# EAGLE design rel-eeprom-prog (EAGLE 9.1.3)
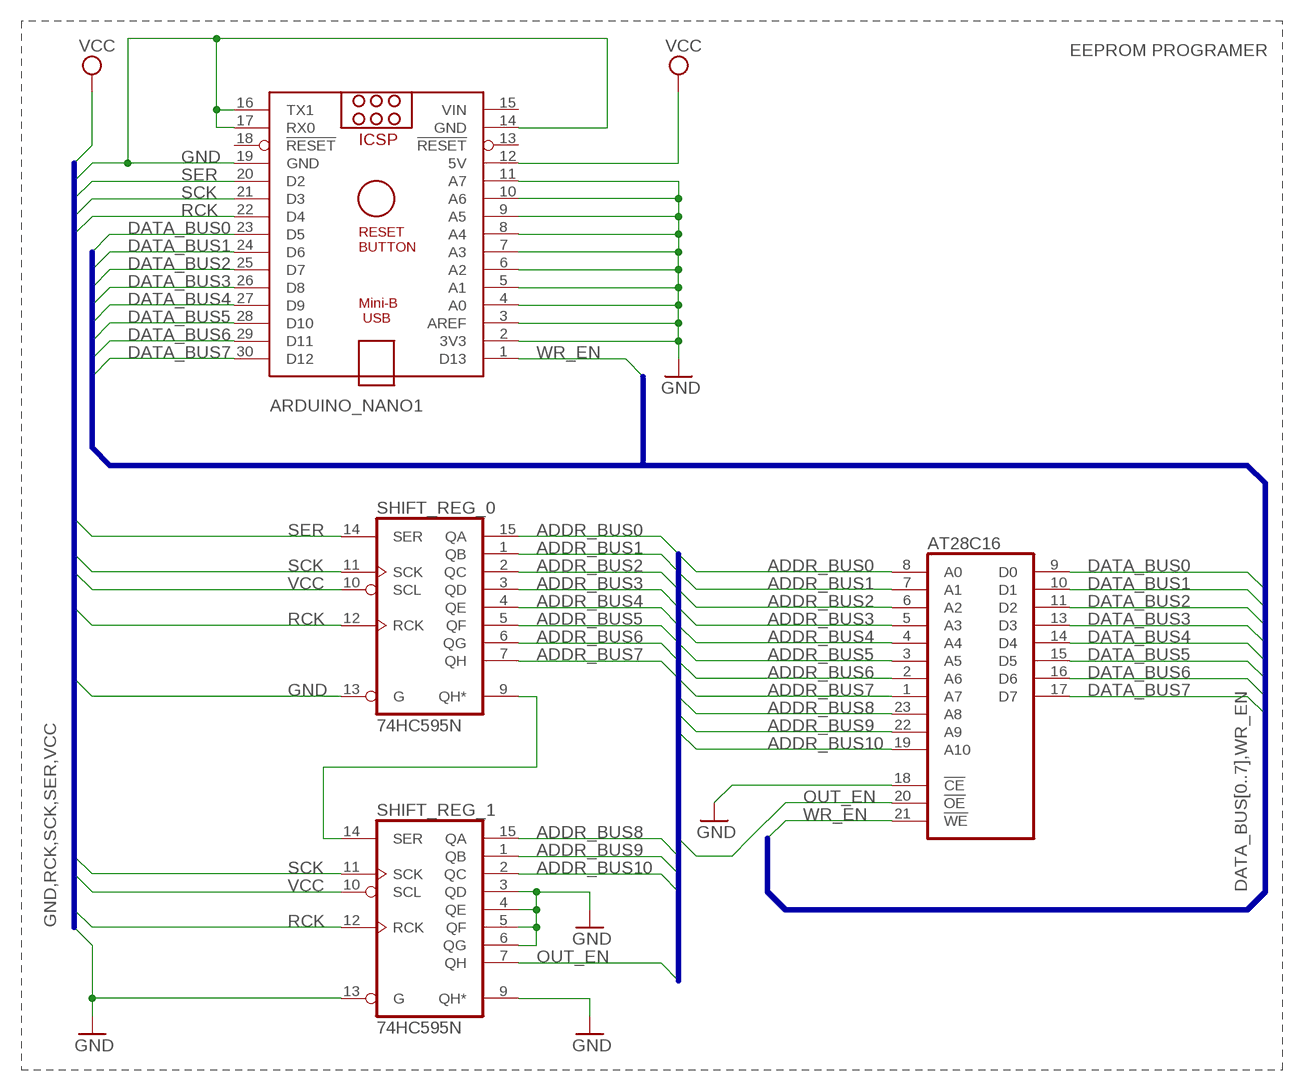
[diagram p0: schematic, sheet 1]

## Parts
ARDUINO_NANO1  ARDUINO_NANO  [ARDUINO_NANO]
AT28C16  2816  [DIL24]
SHIFT_REG_0  74HC595N  [DIL16]
SHIFT_REG_1  74HC595N  [DIL16]

## Nets
ADDR_BUS0: AT28C16.8(A0) SHIFT_REG_0.15(QA)
ADDR_BUS1: AT28C16.7(A1) SHIFT_REG_0.1(QB)
ADDR_BUS2: AT28C16.6(A2) SHIFT_REG_0.2(QC)
ADDR_BUS3: AT28C16.5(A3) SHIFT_REG_0.3(QD)
ADDR_BUS4: AT28C16.4(A4) SHIFT_REG_0.4(QE)
ADDR_BUS5: AT28C16.3(A5) SHIFT_REG_0.5(QF)
ADDR_BUS6: AT28C16.2(A6) SHIFT_REG_0.6(QG)
ADDR_BUS7: AT28C16.1(A7) SHIFT_REG_0.7(QH)
ADDR_BUS8: AT28C16.23(A8) SHIFT_REG_1.15(QA)
ADDR_BUS9: AT28C16.22(A9) SHIFT_REG_1.1(QB)
ADDR_BUS10: AT28C16.19(A10) SHIFT_REG_1.2(QC)
CARRY: SHIFT_REG_0.9(QH*) SHIFT_REG_1.14(SER)
DATA_BUS0: ARDUINO_NANO1.23(D5) AT28C16.9(D0)
DATA_BUS1: ARDUINO_NANO1.24(D6) AT28C16.10(D1)
DATA_BUS2: ARDUINO_NANO1.25(D7) AT28C16.11(D2)
DATA_BUS3: ARDUINO_NANO1.26(D8) AT28C16.13(D3)
DATA_BUS4: ARDUINO_NANO1.27(D9) AT28C16.14(D4)
DATA_BUS5: ARDUINO_NANO1.28(D10) AT28C16.15(D5)
DATA_BUS6: ARDUINO_NANO1.29(D11) AT28C16.16(D6)
DATA_BUS7: ARDUINO_NANO1.30(D12) AT28C16.17(D7)
GND: ARDUINO_NANO1.2(3V3) ARDUINO_NANO1.3(AREF) ARDUINO_NANO1.4(A0) ARDUINO_NANO1.5(A1) ARDUINO_NANO1.6(A2) ARDUINO_NANO1.7(A3) ARDUINO_NANO1.8(A4) ARDUINO_NANO1.9(A5) ARDUINO_NANO1.10(A6) ARDUINO_NANO1.11(A7) ARDUINO_NANO1.14(GND) ARDUINO_NANO1.16(TX1) ARDUINO_NANO1.17(RX0) ARDUINO_NANO1.19(GND) AT28C16.18(!CE) SHIFT_REG_0.13(G) SHIFT_REG_1.3(QD) SHIFT_REG_1.4(QE) SHIFT_REG_1.5(QF) SHIFT_REG_1.6(QG) SHIFT_REG_1.9(QH*) SHIFT_REG_1.13(G)
OUT_EN: AT28C16.20(!OE) SHIFT_REG_1.7(QH)
RCK: ARDUINO_NANO1.22(D4) SHIFT_REG_0.12(RCK) SHIFT_REG_1.12(RCK)
SCK: ARDUINO_NANO1.21(D3) SHIFT_REG_0.11(SCK) SHIFT_REG_1.11(SCK)
SER: ARDUINO_NANO1.20(D2) SHIFT_REG_0.14(SER)
VCC: ARDUINO_NANO1.12(5V) SHIFT_REG_0.10(SCL) SHIFT_REG_1.10(SCL)
WR_EN: ARDUINO_NANO1.1(D13) AT28C16.21(!WE)
Unconnected: ARDUINO_NANO1.13(!RESET) ARDUINO_NANO1.18(!RESET)

## Buses
GND,RCK,SCK,SER,VCC
ADDR_BUS[0..10],OUT_EN
DATA_BUS[0..7],WR_EN

## Notes on the sheet
- EEPROM PROGRAMER

## Power pins joined to a net without a drawn wire
GND: AT28C16.12(GND) SHIFT_REG_0.8(GND) SHIFT_REG_1.8(GND)
VCC: AT28C16.24(VCC) SHIFT_REG_0.16(VCC) SHIFT_REG_1.16(VCC)
VIN: ARDUINO_NANO1.15(VIN)

## Library data of the parts
ARDUINO_NANO1 = ArduinoNanoV30:ARDUINO_NANO: Arduino Nano V3.0 Overview: The Arduino Nano is a small, complete, and breadboard-friendly board based on the ATmega328 (Arduino Nano 3.x) or ATmega168 (Arduino Nano 2.x). It has more or less the same functionality of the Arduino Duemilanove, but in a different package. It lacks only a DC power jack, and works with a Mini-B USB cable instead of a standard one. The Nano was designed and is being produced by Gravitech. Specifications: Microcontroller Atmel ATmega168 or ATmega328 Operating Voltage (logic level) 5 V Input Voltage (recommended) 7-12 V Input Voltage (limits) 6-20 V Digital I/O Pins 14 (of which 6 provide PWM output) Analog Input Pins 8 DC Current per I/O Pin 40 mA Flash Memory 16 KB (ATmega168) or 32 KB (ATmega328) of which 2 KB used by bootloader SRAM 1 KB (ATmega168) or 2 KB (ATmega328) EEPROM 512 bytes (ATmega168) or 1 KB (ATmega328) Clock Speed 16 MHz Dimensions 0.73" x 1.70" Length 45 mm Width 18 mm Weigth 5 g Power: The Arduino Nano can be powered via the Mini-B USB connection, 6-20V unregulated external power supply (pin 30), or 5V regulated external power supply (pin 27). The power source is automatically selected to the highest voltage source. Memory: The ATmega168 has 16 KB of flash memory for storing code (of which 2 KB is used for the bootloader); the ATmega328 has 32 KB, (also with 2 KB used for the bootloader). The ATmega168 has 1 KB of SRAM and 512 bytes of EEPROM (which can be read and written with the EEPROM library); the ATmega328 has 2 KB of SRAM and 1 KB of EEPROM. Input and Output: Each of the 14 digital pins on the Nano can be used as an input or output, using pinMode(), digitalWrite(), and digitalRead() functions. They operate at 5 volts. Each pin can provide or receive a maximum of 40 mA and has an internal pull-up resistor (disconnected by default) of 20-50 kOhms. In addition, some pins have specialized functions. Visit Arduino - ArduinoBoardNano <https://www.arduino.cc/en/Main/ArduinoBoardNano>
AT28C16 = memory:2816: MEMORY
SHIFT_REG_0 SHIFT_REG_1 = 74xx-eu:74*595: 8-bit SHIFT REGISTER, output latch

## Board
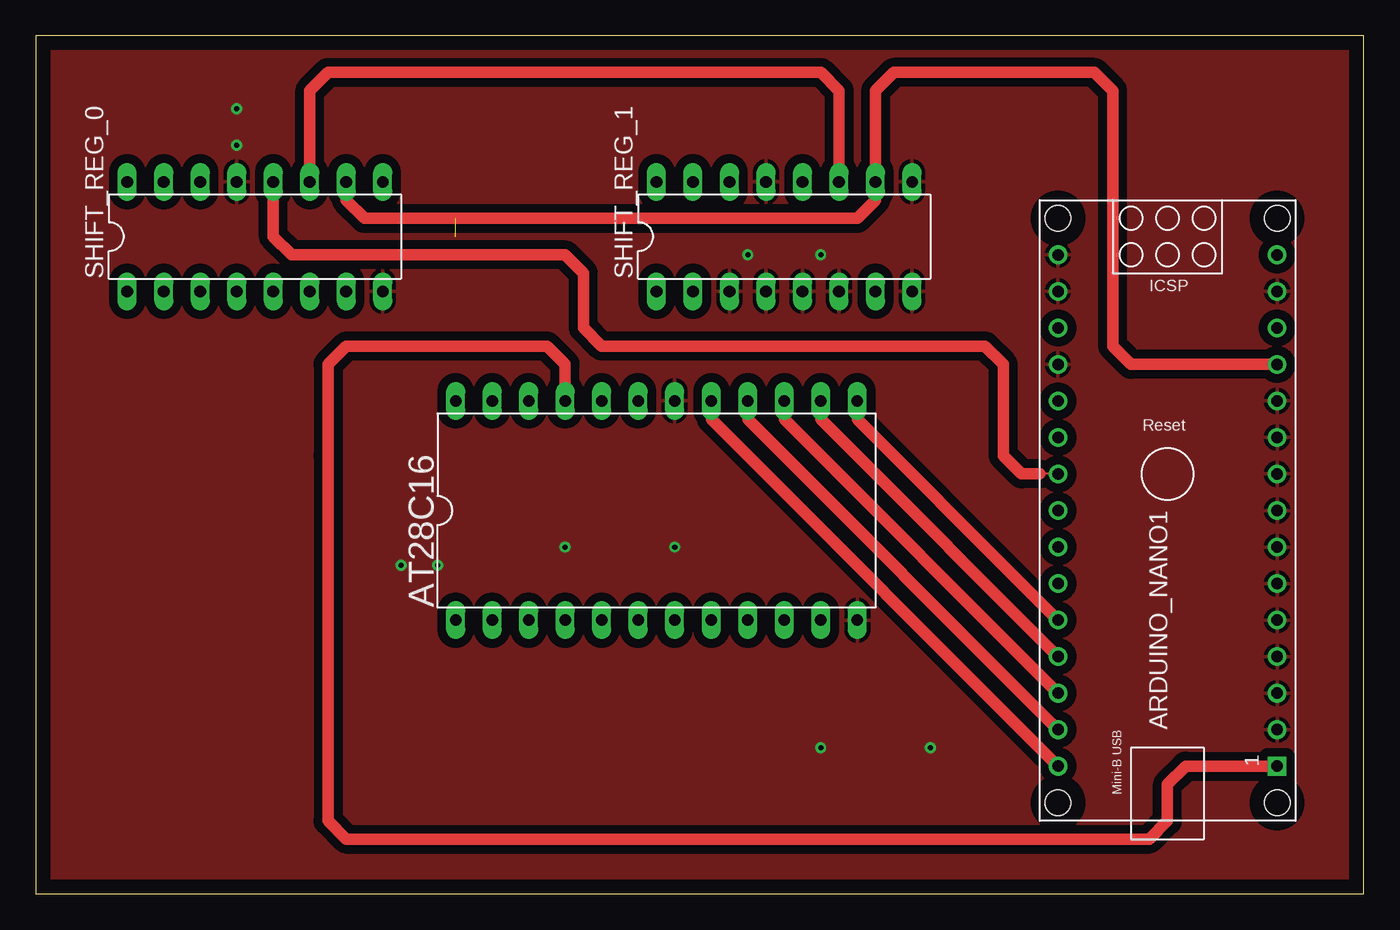
[diagram p1: board, top side]
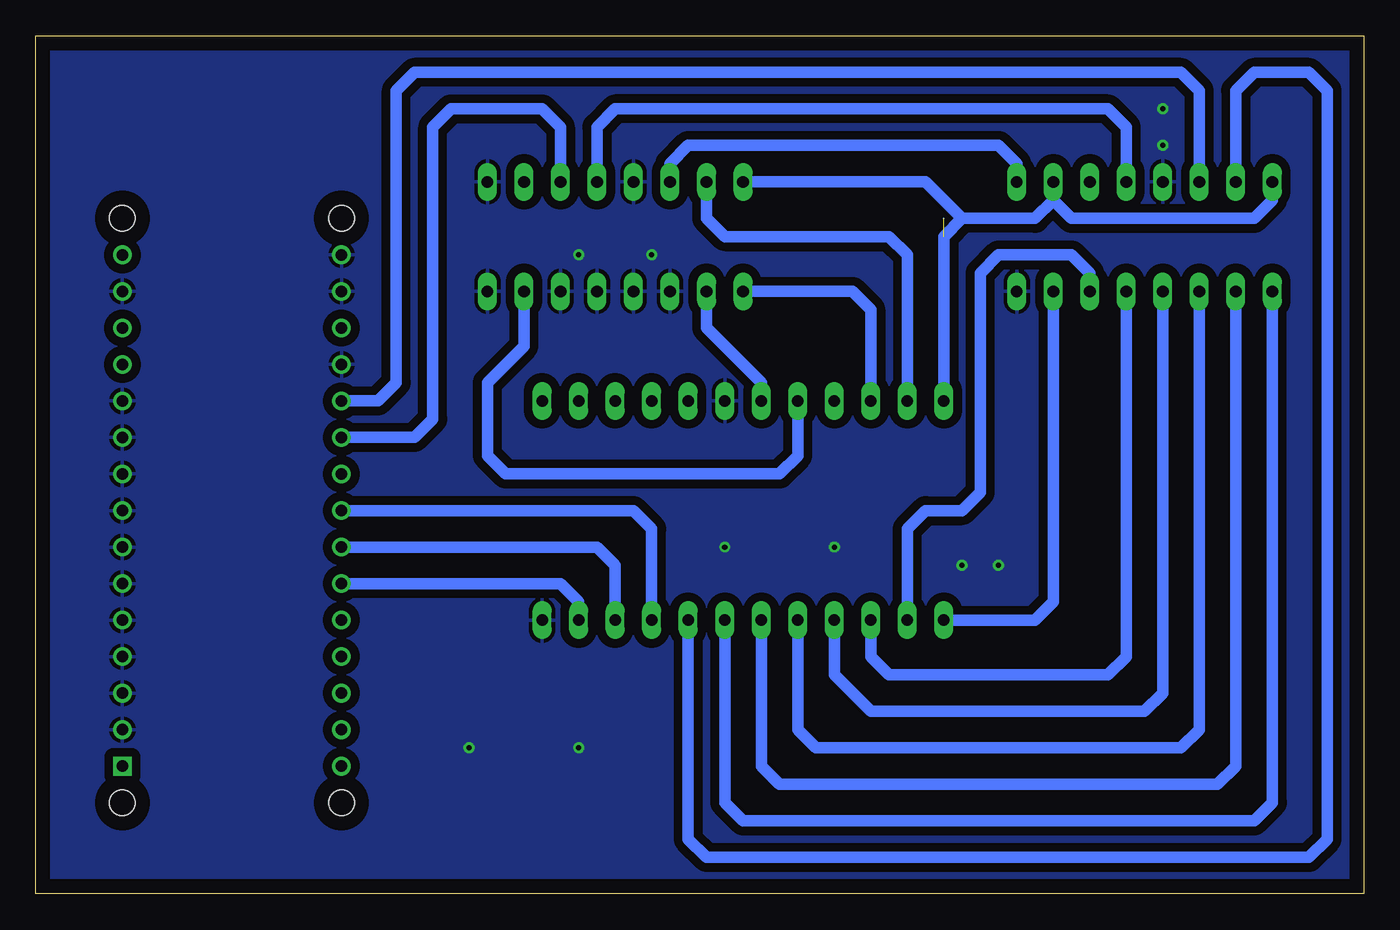
[diagram p2: board, bottom side, seen from below]

Size 92.38 x 59.68 mm. Coordinates in mm from the lower left corner, seen from the top.
Outline: 0,0 92.38,0 92.38,59.68 0,59.68 0,0
Copper layers (1*16): Top 0.035mm / dielectric 1.5mm / Bottom 0.035mm
Design rules "default": minimum track width 6mil, minimum drill 0.35mm, track to track 6mil, track to pad 6mil, pad to pad 6mil, via to via 6mil, smd to smd 6mil, copper to edge 40mil, drill to drill 6mil, minimum pad ring 10mil, minimum via ring 8mil, stop-mask expansion 4mil, vias tented up to drill 0mil, thermal gap 10mil

### Footprints (pad centres in the part's own frame; a part is rotated, then mirrored left to right if it is on the bottom)
ARDUINO_NANO = drill 0.8 square: 1 -20.32,-7.62 | drill 0.8: 2 -17.78,-7.62; 3 -15.24,-7.62; 4 -12.7,-7.62; 5 -10.16,-7.62; 6 -7.62,-7.62; 7 -5.08,-7.62; 8 -2.54,-7.62; 9 0,-7.62; 10 2.54,-7.62; 11 5.08,-7.62; 12 7.62,-7.62; 13 10.16,-7.62; 14 12.7,-7.62; 15 15.24,-7.62; 16 15.24,7.62; 17 12.7,7.62; 18 10.16,7.62; 19 7.62,7.62; 20 5.08,7.62; 21 2.54,7.62; 22 0,7.62; 23 -2.54,7.62; 24 -5.08,7.62; 25 -7.62,7.62; 26 -10.16,7.62; 27 -12.7,7.62; 28 -15.24,7.62; 29 -17.78,7.62; 30 -20.32,7.62 | hole 1.778: -22.86,-7.62; -22.86,7.62; 17.78,7.62; 17.78,-7.62
DIL24 = drill 0.813 long: 1 -13.97,-7.62; 2 -11.43,-7.62; 3 -8.89,-7.62; 4 -6.35,-7.62; 5 -3.81,-7.62; 6 -1.27,-7.62; 7 1.27,-7.62; 8 3.81,-7.62; 9 6.35,-7.62; 10 8.89,-7.62; 11 11.43,-7.62; 12 13.97,-7.62; 13 13.97,7.62; 14 11.43,7.62; 15 8.89,7.62; 16 6.35,7.62; 17 3.81,7.62; 18 1.27,7.62; 19 -1.27,7.62; 20 -3.81,7.62; 21 -6.35,7.62; 22 -8.89,7.62; 23 -11.43,7.62; 24 -13.97,7.62
DIL16 = drill 0.813 long: 1 -8.89,-3.81; 2 -6.35,-3.81; 3 -3.81,-3.81; 4 -1.27,-3.81; 5 1.27,-3.81; 6 3.81,-3.81; 7 6.35,-3.81; 8 8.89,-3.81; 9 8.89,3.81; 10 6.35,3.81; 11 3.81,3.81; 12 1.27,3.81; 13 -1.27,3.81; 14 -3.81,3.81; 15 -6.35,3.81; 16 -8.89,3.81

### Placement (x,y rotation side)
ARDUINO_NANO1  78.74,29.21 90 top
AT28C16  43.18,26.67 0 top
SHIFT_REG_0  15.24,45.72 0 top
SHIFT_REG_1  52.07,45.72 0 top

### Tracks (layer width: path | path; a pad name or v marks a point on that pad's centre or on a via)
ADDR_BUS0
  Bottom 0.813: AT28C16.8 46.99,3.81 45.72,2.54 3.81,2.54 2.54,3.81 2.54,55.88 3.81,57.15 7.62,57.15 8.89,55.88 SHIFT_REG_0.15
ADDR_BUS1
  Bottom 0.813: AT28C16.7 44.45,6.35 43.18,5.08 7.62,5.08 6.35,6.35 SHIFT_REG_0.1
ADDR_BUS2
  Bottom 0.813: AT28C16.6 41.91,8.89 40.64,7.62 10.16,7.62 8.89,8.89 SHIFT_REG_0.2
ADDR_BUS3
  Bottom 0.813: AT28C16.5 39.37,11.43 38.1,10.16 12.7,10.16 11.43,11.43 SHIFT_REG_0.3
ADDR_BUS4
  Bottom 0.813: AT28C16.4 36.83,15.24 34.29,12.7 15.24,12.7 13.97,13.97 SHIFT_REG_0.4
ADDR_BUS5
  Bottom 0.813: SHIFT_REG_0.5 16.51,16.51 17.78,15.24 33.02,15.24 34.29,16.51 AT28C16.3
ADDR_BUS6
  Bottom 0.813: SHIFT_REG_0.6 19.05,43.18 20.32,44.45 25.4,44.45 26.67,43.18 26.67,31.75 26.67,30.48 26.67,27.94 27.94,26.67 30.48,26.67 31.75,25.4 AT28C16.2
ADDR_BUS7
  Bottom 0.813: SHIFT_REG_0.7 21.59,39.37 21.59,20.32 22.86,19.05 AT28C16.1
ADDR_BUS8
  Bottom 0.813: AT28C16.23 31.75,44.45 33.02,45.72 44.45,45.72 45.72,46.99 SHIFT_REG_1.15
ADDR_BUS9
  Bottom 0.813: SHIFT_REG_1.1 35.56,41.91 34.29,40.64 AT28C16.22
ADDR_BUS10
  Bottom 0.813: SHIFT_REG_1.2 45.72,39.37 41.91,35.56 AT28C16.19
CARRY
  Bottom 0.813: SHIFT_REG_1.14 48.26,50.8 46.99,52.07 25.4,52.07 24.13,50.8 SHIFT_REG_0.9
DATA_BUS0
  Bottom 0.813: AT28C16.9 49.53,25.4 50.8,26.67 ARDUINO_NANO1.23
DATA_BUS1
  Bottom 0.813: AT28C16.10 52.07,22.86 53.34,24.13 ARDUINO_NANO1.24
DATA_BUS2
  Bottom 0.813: AT28C16.11 54.61,20.32 55.88,21.59 ARDUINO_NANO1.25
DATA_BUS3
  Top 0.813: ARDUINO_NANO1.26 68.58,21.59 57.15,33.02 AT28C16.13
DATA_BUS4
  Top 0.813: ARDUINO_NANO1.27 55.88,31.75 54.61,33.02 AT28C16.14
DATA_BUS5
  Top 0.813: ARDUINO_NANO1.28 52.07,33.02 AT28C16.15
DATA_BUS6
  Top 0.813: ARDUINO_NANO1.29 49.53,33.02 AT28C16.16
DATA_BUS7
  Top 0.813: ARDUINO_NANO1.30 46.99,33.02 AT28C16.17
GND  (via drill 0.35)
  other vias: 36.83,24.13 44.45,24.13 25.4,22.86 27.94,22.86 54.61,10.16 62.23,10.16 49.53,44.45 54.61,44.45 13.97,52.07 13.97,54.61
  pour Bottom (isolate 0.61): -1.27,60.96 -1.27,-1.27 93.98,-1.27 93.98,60.96
  pour Top (isolate 0.61): -1.27,60.96 -1.27,-1.27 93.98,-1.27 93.98,60.96
OUT_EN
  Bottom 0.813: AT28C16.20 39.37,30.48 40.64,29.21 59.69,29.21 60.96,30.48 60.96,35.56 58.42,38.1 SHIFT_REG_1.7
RCK
  Top 0.152: ARDUINO_NANO1.22 69.85,29.21
  Top 0.813: 69.85,29.21 68.58,29.21 67.31,30.48 67.31,36.83 66.04,38.1 39.37,38.1 38.1,39.37 38.1,43.18 36.83,44.45 17.78,44.45 16.51,45.72 SHIFT_REG_0.12
  Bottom 0.813: SHIFT_REG_1.12 53.34,53.34 52.07,54.61 17.78,54.61 16.51,53.34 SHIFT_REG_0.12
SCK
  Top 0.813: SHIFT_REG_0.11 19.05,55.88 20.32,57.15 54.61,57.15 55.88,55.88 SHIFT_REG_1.11
  Bottom 0.813: SHIFT_REG_1.11 55.88,53.34 57.15,54.61 63.5,54.61 64.77,53.34 64.77,33.02 66.04,31.75 ARDUINO_NANO1.21
SER
  Bottom 0.813: SHIFT_REG_0.14 11.43,55.88 12.7,57.15 66.04,57.15 67.31,55.88 67.31,35.56 68.58,34.29 ARDUINO_NANO1.20
VCC  (1 unrouted)
  Top 0.152: 58.42,48.26 SHIFT_REG_1.10
  Top 0.813: SHIFT_REG_1.10 58.42,55.88 59.69,57.15 73.66,57.15 74.93,55.88 74.93,38.1 76.2,36.83 ARDUINO_NANO1.12 | SHIFT_REG_0.10 21.59,48.26 22.86,46.99 57.15,46.99 58.42,48.26
  Bottom 0.152: 21.59,48.26 SHIFT_REG_0.10 | 29.21,46.99
  Bottom 0.813: 21.59,48.26 22.86,46.99 27.94,46.99 | SHIFT_REG_0.10 21.59,48.26 | 21.59,48.26 20.32,46.99 7.62,46.99 6.35,48.26 SHIFT_REG_0.16 | 27.94,46.99 29.21,45.72 AT28C16.24 | SHIFT_REG_1.16 30.48,49.53 27.94,46.99
WR_EN
  Top 0.813: AT28C16.21 36.83,36.83 35.56,38.1 29.21,38.1 26.67,38.1 21.59,38.1 20.32,36.83 20.32,30.48 20.32,5.08 21.59,3.81 77.47,3.81 78.74,5.08 78.74,7.62 80.01,8.89 ARDUINO_NANO1.1